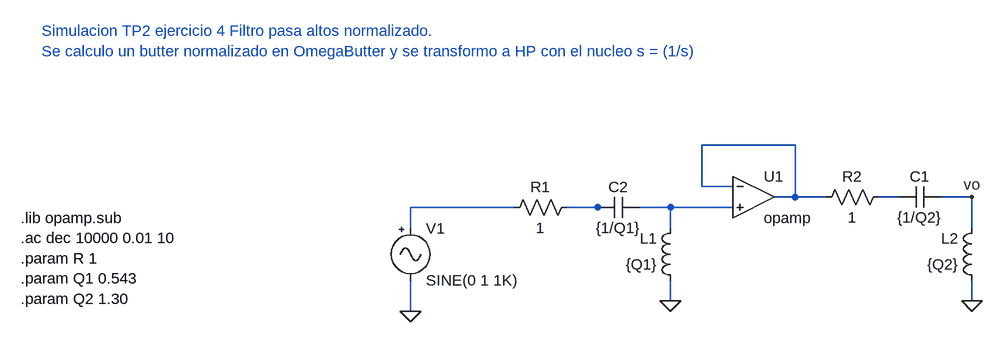
[diagram p0: schematic tp_2_4_normalizado.asc]
tp_2_4_normalizado.asc, the LTspice schematic file:
Version 4
SHEET 1 880 680
WIRE 544 192 400 192
WIRE 400 256 400 192
WIRE 448 256 400 256
WIRE 544 272 544 192
WIRE 544 272 512 272
WIRE 592 272 544 272
WIRE 704 272 672 272
WIRE 816 272 768 272
WIRE 112 288 -48 288
WIRE 240 288 192 288
WIRE 256 288 240 288
WIRE 352 288 304 288
WIRE 448 288 352 288
WIRE -48 320 -48 288
WIRE 352 320 352 288
WIRE 816 320 816 272
WIRE 352 432 352 400
WIRE 816 432 816 400
WIRE -48 448 -48 400
FLAG 352 432 0
FLAG 816 432 0
FLAG -48 448 0
FLAG 816 272 vo
SYMBOL Opamps/opamp 480 208 R0
SYMATTR InstName U1
SYMBOL res 208 272 R90
WINDOW 0 0 56 VBottom 2
WINDOW 3 32 56 VTop 2
SYMATTR InstName R1
SYMATTR Value 1
SYMBOL res 688 256 R90
WINDOW 0 0 56 VBottom 2
WINDOW 3 32 56 VTop 2
SYMATTR InstName R2
SYMATTR Value 1
SYMBOL ind 368 416 R180
WINDOW 0 36 80 Left 2
WINDOW 3 36 40 Left 2
SYMATTR InstName L1
SYMATTR Value {Q1}
SYMBOL ind 832 416 R180
WINDOW 0 36 80 Left 2
WINDOW 3 36 40 Left 2
SYMATTR InstName L2
SYMATTR Value {Q2}
SYMBOL cap 768 256 R90
WINDOW 0 0 32 VBottom 2
WINDOW 3 32 32 VTop 2
SYMATTR InstName C1
SYMATTR Value {1/Q2}
SYMBOL cap 304 272 R90
WINDOW 0 0 32 VBottom 2
WINDOW 3 32 32 VTop 2
SYMATTR InstName C2
SYMATTR Value {1/Q1}
SYMBOL Misc/signal -48 304 R0
SYMATTR InstName V1
SYMATTR Value2 AC 1
TEXT -648 304 Left 2 !.lib opamp.sub\n.ac dec 10000 0.01 10\n.param R 1\n.param Q1 0.543\n.param Q2 1.30
TEXT -616 16 Left 2 ;Simulacion TP2 ejercicio 4 Filtro pasa altos normalizado.\nSe calculo un butter normalizado en OmegaButter y se transformo a HP con el nucleo s = (1/s)

The netlist it stands for:
* tp_2_4_normalizado.asc
XU1 N001 N005 N001 opamp Aol=100K GBW=10Meg  ; pins invin noninvin out
R1 N004 N003 1
R2 N002 N001 1
L1 0 N005 {Q1}
L2 0 vo {Q2}
C1 vo N002 {1/Q2}
C2 N005 N004 {1/Q1}
V1 N003 0 SINE(0 1 1K) AC 1
.lib opamp.sub
.ac dec 10000 0.01 10
.param R 1
.param Q1 0.543
.param Q2 1.30
* Simulacion TP2 ejercicio 4 Filtro pasa altos normalizado.
* Se calculo un butter normalizado en OmegaButter y se transformo a HP con el nucleo s = (1/s)
.backanno
.end